# Altium schematic sheet CZ ESP32 Schematic.SchDoc
size A3
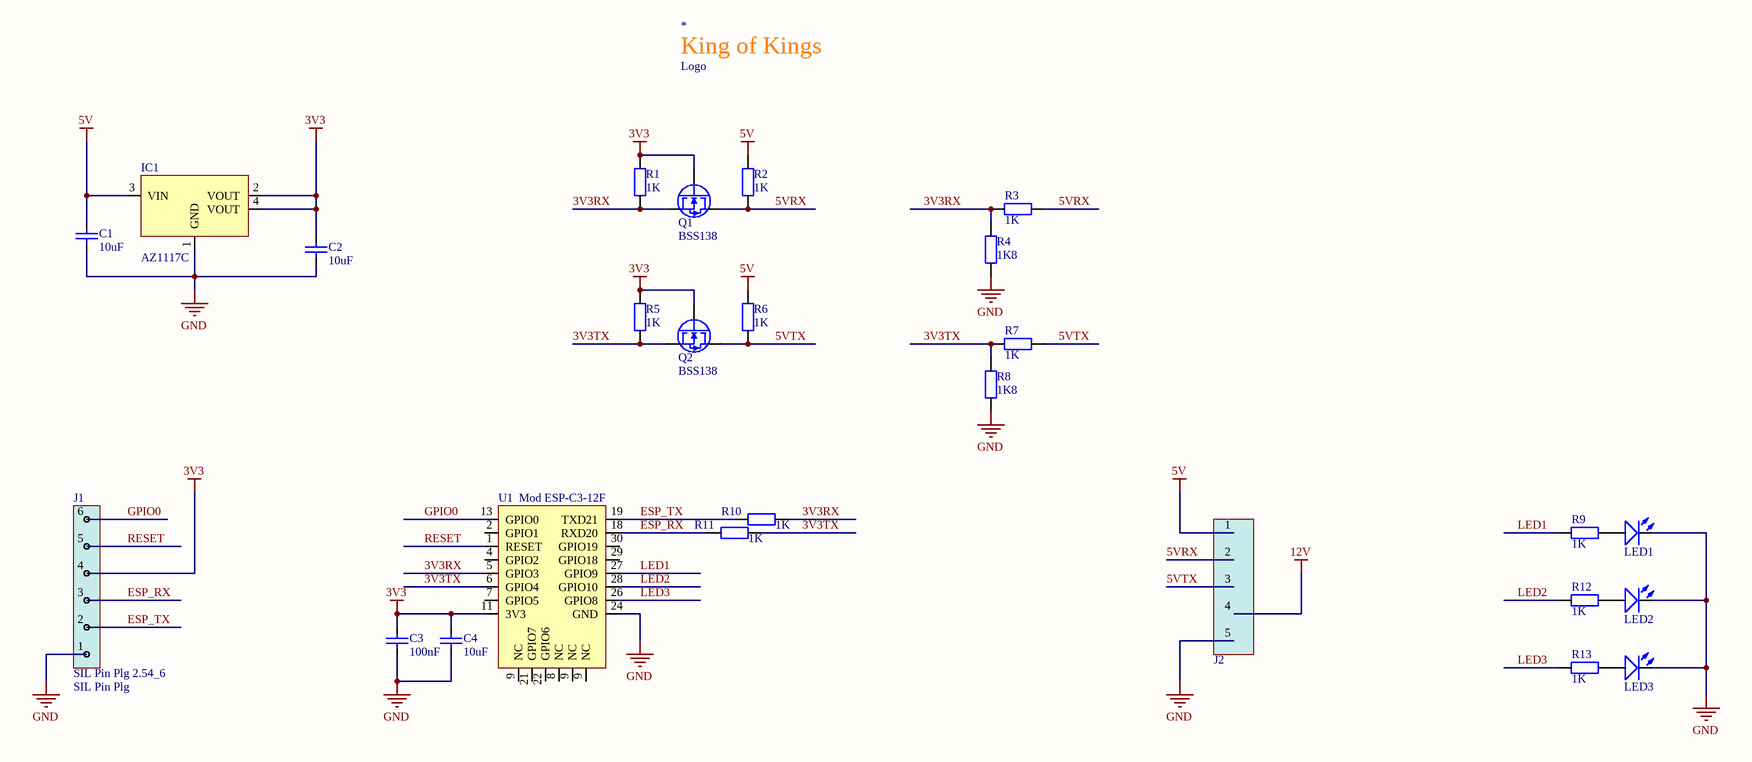
[diagram p0: CZ ESP32 Schematic.SchDoc]

## Parts
*  Logo  [KingofKingsSmall]
C1  value 10uF  [Cap - 0805 - SML]
C2  value 10uF  [Cap - 0805 - SML]
C3  value 100nF  [Cap - 0805 - SML]
C4  value 10uF  [Cap - 0805 - SML]
IC1  AZ1117C  [sot223-4]
J1  SIL Pin Plg 2.54_6  Type: SIL Pin Plg  [SIL PIN PLG 2.54_6]
J2  JST-PA  [JST PA-5 2mm RA]  (value not drawn)
LED1  LTST-C190EKT  [LTST-C190EKT]  (value not drawn)
LED2  LTST-C190EKT  [LTST-C190EKT]  (value not drawn)
LED3  LTST-C190EKT  [LTST-C190EKT]  (value not drawn)
Q1  BSS138  [SOT23-3]
Q2  BSS138  [SOT23-3]
R1  value 1K  [Res - 0603 - SML]  (hidden comment: Res SMD)
R2  value 1K  [Res - 0603 - SML]  (hidden comment: Res SMD)
R3  value 1K  [Res - 0603 - SML]  (hidden comment: Res SMD)
R4  value 1K8  [Res - 0603 - SML]  (hidden comment: Res SMD)
R5  value 1K  [Res - 0603 - SML]  (hidden comment: Res SMD)
R6  value 1K  [Res - 0603 - SML]  (hidden comment: Res SMD)
R7  value 1K  [Res - 0603 - SML]  (hidden comment: Res SMD)
R8  value 1K8  [Res - 0603 - SML]  (hidden comment: Res SMD)
R9  value 1K  [Res - 0603 - SML]  (hidden comment: Res SMD)
R10  value 1K  [Res - 0603 - SML]  (hidden comment: Res SMD)
R11  value 1K  [Res - 0603 - SML]  (hidden comment: Res SMD)
R12  value 1K  [Res - 0603 - SML]  (hidden comment: Res SMD)
R13  value 1K  [Res - 0603 - SML]  (hidden comment: Res SMD)
U1  Mod ESP-C3-12F  [ESP-C3-12F]

## Nets
3V3: C2.2 C3.2 C4.2 IC1.2(VOUT) IC1.4(VOUT) J1.4 Q1.1(Gate) Q2.1(Gate) R1.2 R5.2 U1.11(3V3)
5V: C1.2 IC1.3(VIN) J2.1 R2.2 R6.2
12V: J2.4
GND: C1.1 C2.1 C3.1 C4.1 IC1.1(GND) J1.1 J2.5 LED1.2(Cathode) LED2.2(Cathode) LED3.2(Cathode) R4.1 R8.1 U1.24(GND)
3V3RX: Q1.2(Source) R1.1 R3.2 R4.2 R10.1 U1.5(GPIO3)
3V3TX: Q2.2(Source) R5.1 R7.2 R8.2 R11.1 U1.6(GPIO4)
5VRX: J2.2 Q1.3(Drain) R2.1 R3.1
5VTX: J2.3 Q2.3(Drain) R6.1 R7.1
ESP_RX: J1.3 R11.2 U1.18(RXD20)
ESP_TX: J1.2 R10.2 U1.19(TXD21)
GPIO0: J1.6 U1.13(GPIO0)
LED1: R9.1 U1.27(GPIO9)
LED2: R12.1 U1.28(GPIO10)
LED3: R13.1 U1.26(GPIO8)
RESET: J1.5 U1.1(RESET)
NetLED1_1: LED1.1(Anode) R9.2
NetLED2_1: LED2.1(Anode) R12.2
NetLED3_1: LED3.1(Anode) R13.2

Not connected (* = marked no-connect by the designer): U1 2(GPIO1) 4(GPIO2) 7(GPIO5) 8(NC) 9(NC) 21(GPIO7) 22(GPIO6) 29(GPIO18) 30(GPIO19)

## Notes on the sheet
- (in symbol Logo) King of Kings

## Library data of the parts
C1-C4 = Cap SMD Ceramic: Current Footprint: Cap - 0805 - SML
IC1 = IC REG AZ1117CH-3.3: IC REG LINEAR 3.3V 800MA SOT223; Manufacturer Part Number: AZ1117CH-3.3TRG1
J1 = SIL Pin Plg 2.54_6: 6 Way SIL Pins; Current: 2A; Voltage: 250V; Pitch: 2.54mm; Part Number: *
J2 = Conn JST PA SM05B
LED1-LED3 = LTST-C190EKT: LED RED CLEAR 0603 SMD
Q1 Q2 = N-FET 50V 0.22A: MOSFET N-CH 50V 220MA SOT23-3; Supplier 1: Digi-Key; Supplier Part Number 1: 497-2481-5-ND; HelpURL: http://www.st.com/web/en/resource/technical/document/datasheet/CD00000968.pdf